# Altium schematic sheet obc-v2_CM4-M2.SchDoc
size 420 x 297 mm; SheetNumber: 15; SheetTotal: 23
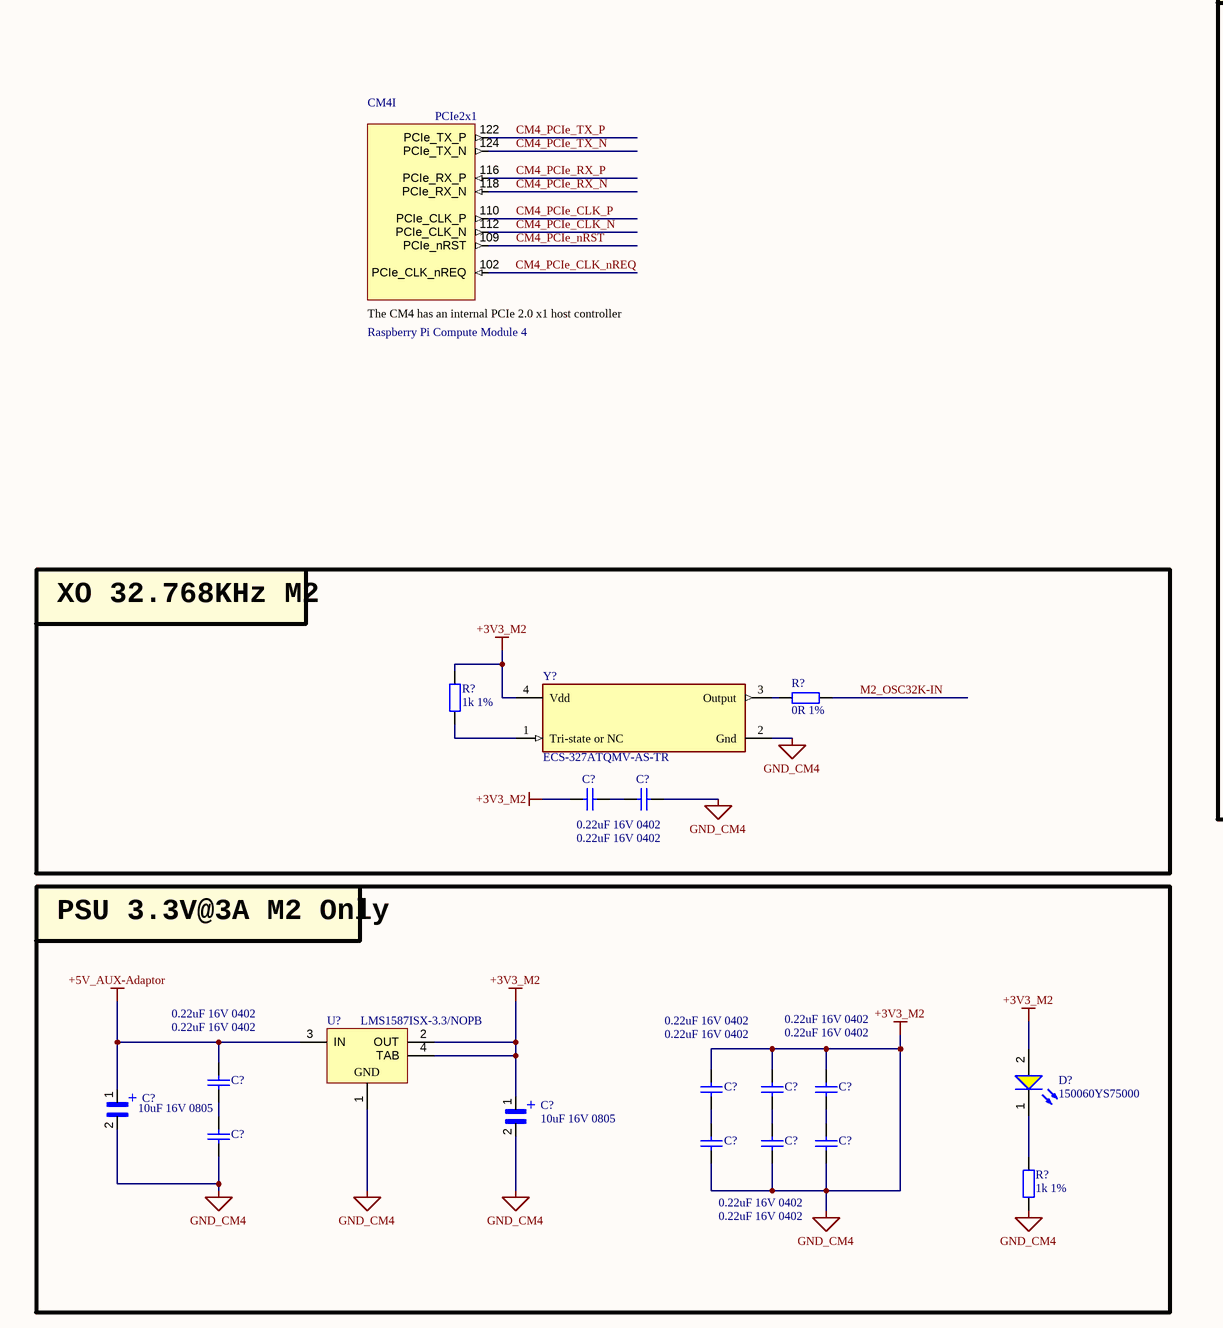
[diagram p0: obc-v2_CM4-M2.SchDoc, left]
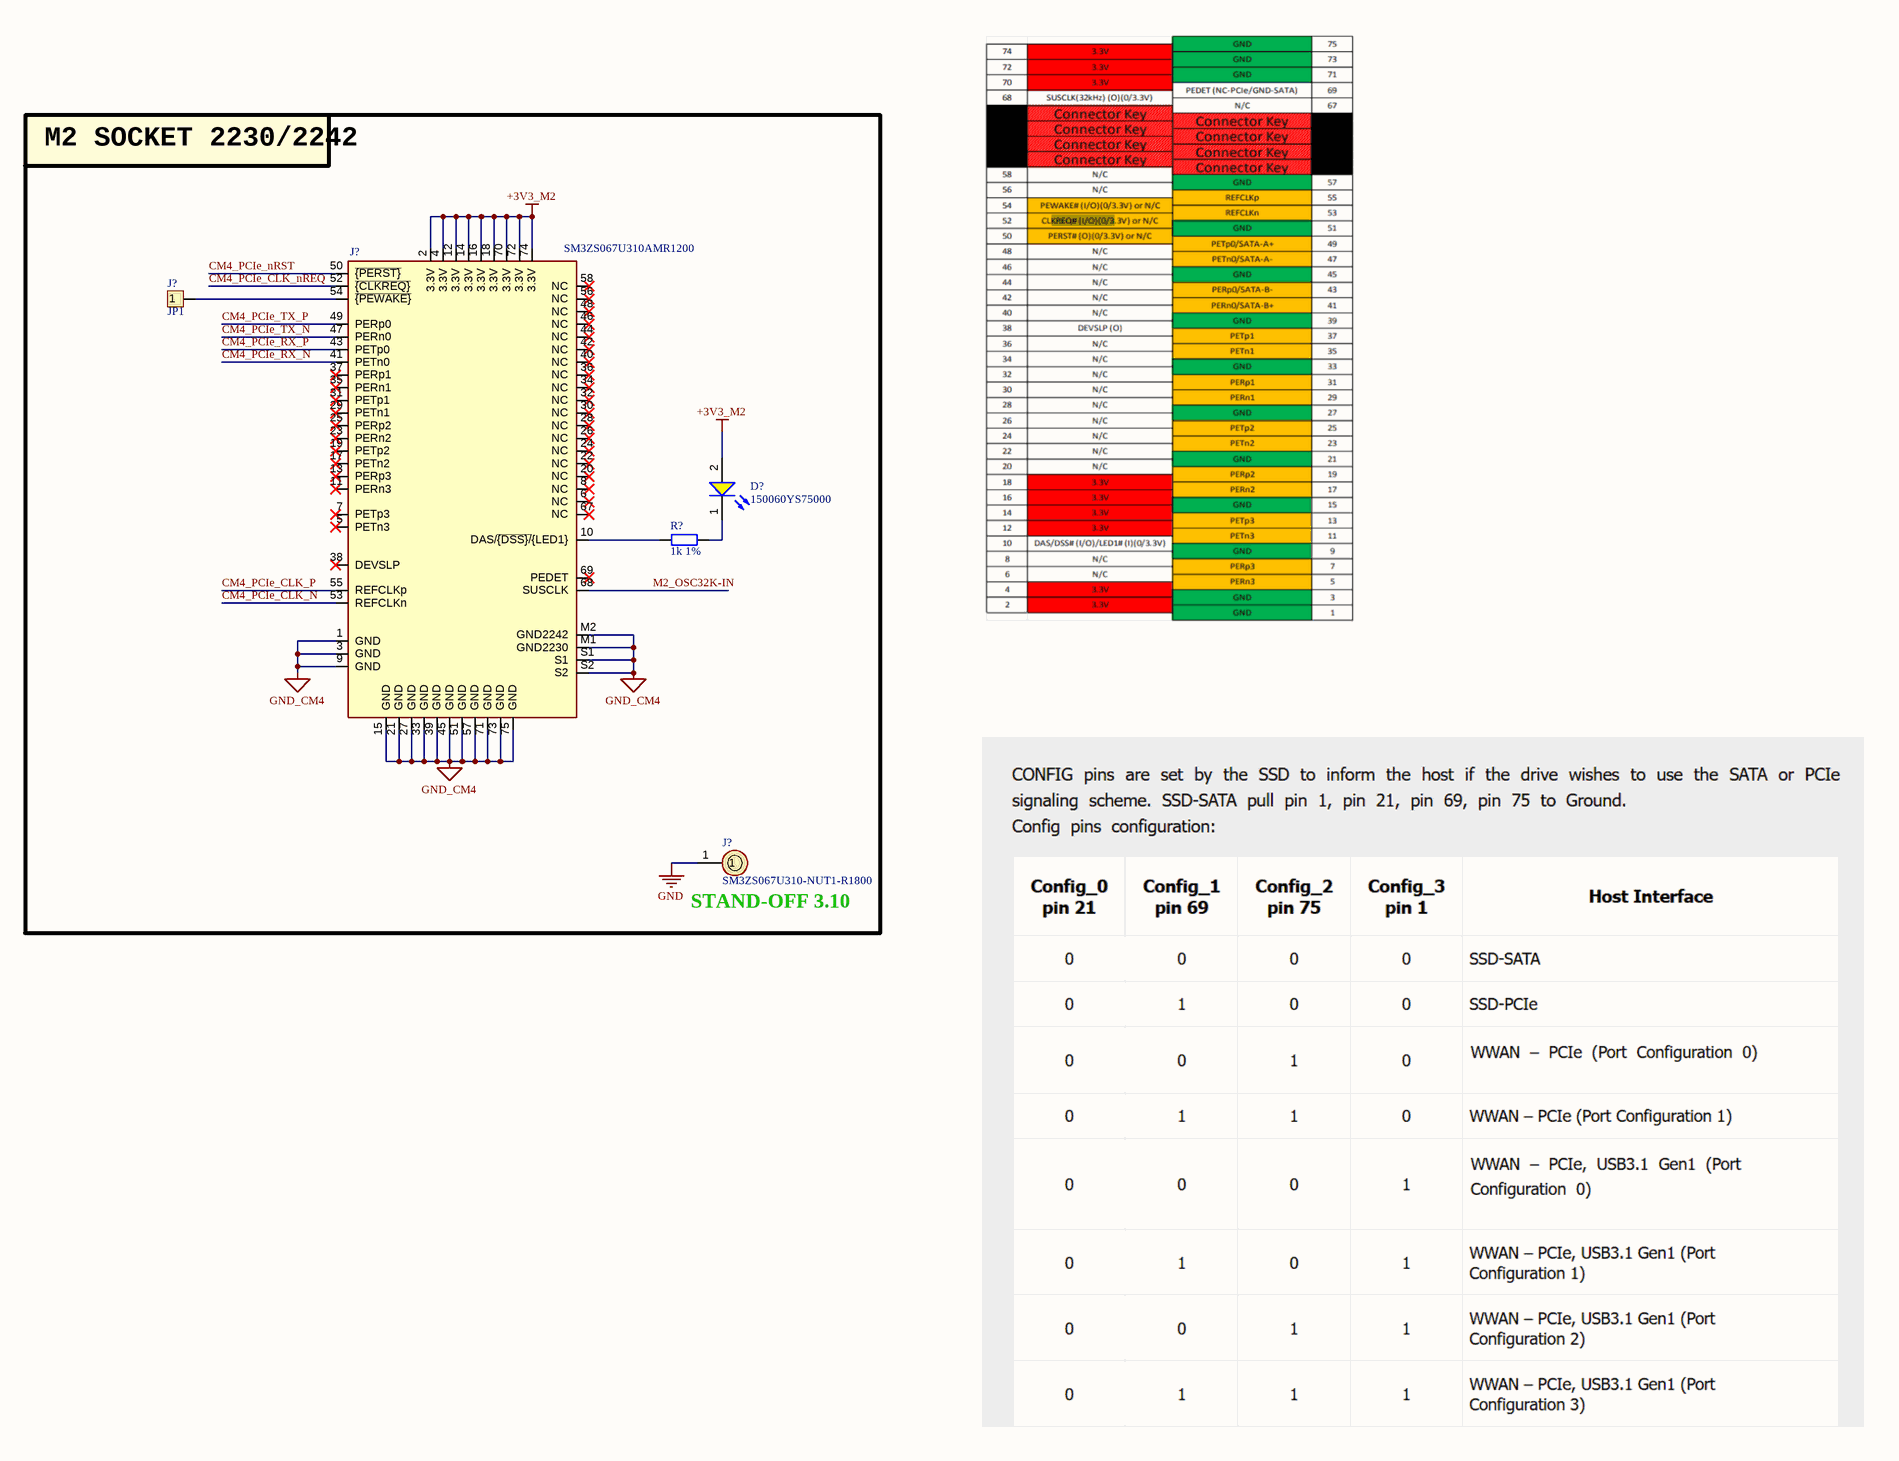
[diagram p1: obc-v2_CM4-M2.SchDoc, right]

## Parts
(Parts that share a designator on the sheet are numbered #1, #2 ... from top to bottom, then left to right.)
C?#1  0.22uF 16V 0402  [tu 0402]
C?#2  0.22uF 16V 0402  [tu 0402]
C?#3  0.22uF 16V 0402  [tu 0402]
C?#4  0.22uF 16V 0402  [tu 0402]
C?#5  0.22uF 16V 0402  [tu 0402]
C?#6  0.22uF 16V 0402  [tu 0402]
C?#7  10uF 16V 0805  [CAPC2012X140N]
C?#8  10uF 16V 0805  [CAPC2012X140N]
C?#9  0.22uF 16V 0402  [tu 0402]
C?#10  0.22uF 16V 0402  [tu 0402]
C?#11  0.22uF 16V 0402  [tu 0402]
C?#12  0.22uF 16V 0402  [tu 0402]
CM4  Raspberry Pi Compute Module 4  [CM4-DF40HC(3.0)-100DS-0.4v_3mm_1.5mm]  (part I of 21)  (no BOM)
D?#1  150060YS75000  [WL-SMCW_0603_150060xx75000]
D?#2  150060YS75000  [WL-SMCW_0603_150060xx75000]
J?#1  JP1  [JP1-D1T]
J?#2  value SM3ZS067U310AMR1200  [M.2 M Key socket]  (hidden comment: Bus_M.2_Socket_M)
J?#3  SM3ZS067U310-NUT1-R1800  [SM3ZS067U310NUT1R1800]
R?#1  1k 1%  [tro smd 0603]
R?#2  1k 1%  [tro smd 0603]
R?#3  0R 1%  [tro smd 0603]
R?#4  1k 1%  [tro smd 0603]
U?  LMS1587ISX-3.3/NOPB  [TS3B_L]
Y?  ECS-327ATQMV-AS-TR  [FP-327ATQMV-MFG]

## Blocks framed on the sheet
M2 SOCKET 2230/2242: D?#1 J?#1-J?#3 R?#1
XO 32.768KHz M2: C?#1 C?#2 R?#2 R?#3 Y?
PSU 3.3V@3A M2 Only: C?#3-C?#12 D?#2 R?#4 U?

## Nets
+3V3_M2: C?#1.1 C?#2.2 C?#4.1 C?#5.1 C?#6.1 C?#7.2 C?#8.1 C?#8.2 C?#9.2 C?#10.2 C?#11.2 C?#12.2 D?#1.2(A) D?#2.2(A) J?#2.1(GND) J?#2.2(3.3V) J?#2.3(GND) J?#2.4(3.3V) J?#2.9(GND) J?#2.12(3.3V) J?#2.14(3.3V) J?#2.15(GND) J?#2.16(3.3V) J?#2.18(3.3V) J?#2.21(GND) J?#2.27(GND) J?#2.33(GND) J?#2.39(GND) J?#2.45(GND) J?#2.51(GND) J?#2.57(GND) J?#2.70(3.3V) J?#2.71(GND) J?#2.72(3.3V) J?#2.73(GND) J?#2.74(3.3V) J?#2.75(GND) J?#2.M1(GND2230) J?#2.M2(GND2242) J?#2.S1 J?#2.S2 R?#2.1 R?#4.2 U?.1(GND) U?.2(OUT) U?.4(TAB) Y?.2(Gnd) Y?.4(Vdd)  [also labelled GND_CM4]
+5V_AUX-Adaptor: C?#3.1 C?#7.1 U?.3(IN)
GND: J?#3.1
CM4_PCIe_CLK_N: CM4.112(PCIe_CLK_N) J?#2.53(REFCLKn)
CM4_PCIe_CLK_nREQ: CM4.102(PCIe_CLK_nREQ) J?#2.52(~{{CLKREQ}})
CM4_PCIe_CLK_P: CM4.110(PCIe_CLK_P) J?#2.55(REFCLKp)
CM4_PCIe_nRST: CM4.109(PCIe_nRST) J?#2.50(~{{PERST}})
CM4_PCIe_RX_N: CM4.118(PCIe_RX_N) J?#2.41(PETn0)
CM4_PCIe_RX_P: CM4.116(PCIe_RX_P) J?#2.43(PETp0)
CM4_PCIe_TX_N: CM4.124(PCIe_TX_N) J?#2.47(PERn0)
CM4_PCIe_TX_P: CM4.122(PCIe_TX_P) J?#2.49(PERp0)
M2_OSC32K-IN: J?#2.68(SUSCLK) R?#3.1
NetC?#1_2: C?#1.2 C?#2.1
NetC?#3_2: C?#3.2 C?#9.1
NetC?#4_2: C?#4.2 C?#10.1
NetC?#5_2: C?#5.2 C?#11.1
NetC?#6_2: C?#6.2 C?#12.1
NetD?#1_1: D?#1.1(K) R?#1.1
NetD?#2_1: D?#2.1(K) R?#4.1
NetJ?#1_1: J?#1.1 J?#2.54(~{{PEWAKE}})
NetJ?#2_10: J?#2.10(DAS/~{{DSS}/}{LED1}) R?#1.2
NetR?#2_2: R?#2.2 Y?.1(Tri-state_or_NC)
NetR?#3_2: R?#3.2 Y?.3(Output)

Not connected (* = marked no-connect by the designer): J?#2 5(PETn3)* 6(NC)* 7(PETp3)* 8(NC)* 11(PERn3)* 13(PERp3)* 17(PETn2)* 19(PETp2)* 20(NC)* 22(NC)* 23(PERn2)* 24(NC)* 25(PERp2)* 26(NC)* 28(NC)* 29(PETn1)* 30(NC)* 31(PETp1)* 32(NC)* 34(NC)* 35(PERn1)* 36(NC)* 37(PERp1)* 38(DEVSLP)* 40(NC)* 42(NC)* 44(NC)* 46(NC)* 48(NC)* 56(NC)* 58(NC)* 67(NC)* 69(PEDET)*

## Notes on the sheet
- (near J?#3) STAND-OFF 3.10
- Project:
- Sub-system:
- Design by:
- Sheet title:
- Sheet
- A3
- of
- Checked by:
- Approved by:
- Revision:
- Document No:
- Size:
- Date:
- (in symbol CM4, part I) PCIe2x1; The CM4 has an internal PCIe 2.0 x1 host controller
- (in symbol TACR686M003RTA) +

## Library data of the parts
C?#1-C?#6 C?#9-C?#12 = Tu 0402 33nF 10V: 0.22 µF ±10% 16V Ceramic Capacitor X7R 0402 (1005 Metric): GCM155R71C224KE02D; Chung_Loai: Dán; Don_Vi: Con; So_Chan: 2; Ten_Linh_Kien: Tụ 0402 33nF X7R 10V GRM155R71A333KA01D; Ma_Hang: MH007853; Kieu_Chan: *
C?#7 C?#8 = TACR686M003RTA: 10 µF Molded Tantalum Capacitors 16 V 0805 (2012 Metric) 8Ohm @ 100kHz: TP8R106M016C; MF: AVX; Availability: Unavailable; SnapEDA_Link: https://www.snapeda.com/parts/TACR686M003RTA/AVX/view-part/1745975/?ref=snap; MP: TACR686M003RTA; Value: *; Price: None; Package: 0805 AVX
CM4 = CM4: Raspberry Pi Compute Module 4 by Amornthep Phunsin
D?#1 D?#2 = CMP-1426-00005-2: LED YELLOW CLEAR 0603 SMD; NexarPartId: 29687085; Wavelength: 590nm; Luminous Intensity: 120mcd; Peak Wavelength: 595nm; Forward Current: 100mA; Power Dissipation: 72mW; Forward Voltage: 2V; Test Current: 20mA; Reverse Voltage: 5V; Lens Style: Clear, Rectangular; Max Junction Temperature (Tj): 95°C; Viewing Angle: 140°; Case Code (Imperial): 0603; Height: 700µm; REACH SVHC: Unknown; Dominant Wavelength: 590nm; Min Operating Temperature: -40°C; Color: Yellow; Width: 800µm; Mount: Surface Mount; Packaging: Tape and Reel; Max Operating Temperature: 85°C; RoHS: Compliant; Max Reverse Voltage (DC): 5V; Case Code (Metric): 1608; Length: 1.6mm; Case/Package: 0603
J?#1 = JP1: WR-PHD 2.54 mm Angled Socket Header; Manufacturer: W¨¹rth Elektronik eiSos GmbH; partNo: 613002143121; ComponentLink1 Description: Manufacturer; ComponentLink2 Description: Datasheet; NoPins: 02; Created Date: 29 March 2013; ComponentLink1URL: http://www.we-online.com; ComponentLink2URL: http://katalog.we-online.de/em/datasheet/6130xx143121.pdf; Created by: Karrer Zheng
J?#2 = Bus_M.2_Socket_M: Part Description: M.2 M Key connector; Field5: MTSSD03-67MSW337; Field7: MTCONN; Field6: MTSSD03-67MSW337; Footprint: CM5IO:M.2 M Key socket
J?#3 = SM3ZS067U310-NUT1-R1800: On-board mounting type, PCI-SIG M.2 Specification compatible, Compatible Connector: SM3ZS067U310*, nut; Manufacturer_Name: JAE; Geometry.Height: 2.16mm; Mouser Part Number: 656-SM3ZS67U31NT1800; Mouser Price/Stock: https://www.mouser.co.uk/ProductDetail/JAE-Electronics/SM3ZS067U310-NUT1-R1800?qs=KdTYp8tcPglw%252BOu69xOHRA%3D%3D; Manufacturer_Part_Number: SM3ZS067U310-NUT1-R1800; Datasheet Link: https://www.jae.com/direct/topics/topics_file_download/topics_id=68932&ext_no=06&_lang=en&v=
R?#1 R?#4 = Tro 0603 1% 10k: RES SMD 2.2K OHM 1% 1/10W 0603, P/N: ERJ-3EKF2201V; Chung_Loai: Dán; Don_Vi: Con; So_Chan: 2; Ten_Linh_Kien: Trở 0603 1% 10k; Ma_Hang: MH006333; Kieu_Chan: *
R?#2 R?#3 = Tro 0603 1% 10k: RES 4.7K OHM 1% 1/10W 0603, P/N: ERJ-U03F4701V; Chung_Loai: Dán; Don_Vi: Con; So_Chan: 2; Ten_Linh_Kien: Trở 0603 1% 10k; Ma_Hang: MH006333; Kieu_Chan: *
U? = CMP-0062-00180-3: 3A Low Dropout Fast Response Regulators, 3-pin TO-263, Pb-Free; Manufacturer: National Semiconductor; PowerWise: N; High-Reliability: Y; PackageTopMarking: NSUZXYTTE#*LMS1587*IS-3.3; CompType: LDO IC; ComponentLink1Description: Manufacturer URL; PackageReference: TS3B; ComponentLink1URL: http://www.national.com/; ComponentLink2URL: http://www.national.com/ds/LM/LMS1587.pdf; DatasheetVersion: Jun-2005; ComponentLink3URL: http://www.national.com/pf/LM/LMS1587.html; PartNumber: LMS1587ISX-3.3/NOPB; RevisionNote: SCH symbol layout adjusted; PinCount: 3; RoHS: Y; Code_JEDEC: MO-169-AA; PackageDescription: TO-263, Molded, .400 x .390 x .180in, 3 Lead, .1in Pitch, Surface Mount; ComponentLink4Description: TS3B Package Page; ComponentLink3Description: LMS1587 Web Page; PackageVersion: revF, Apr-2005; ComponentLink2Description: LMS1587 Datasheet; ComponentLink4URL: http://www.national.com/packaging/folders/ts3b.html
Y? = CMP-40224-000027-1: XTAL OSC XO 32.7680KHZ CMOS SMD; RoHS Compliant: Yes